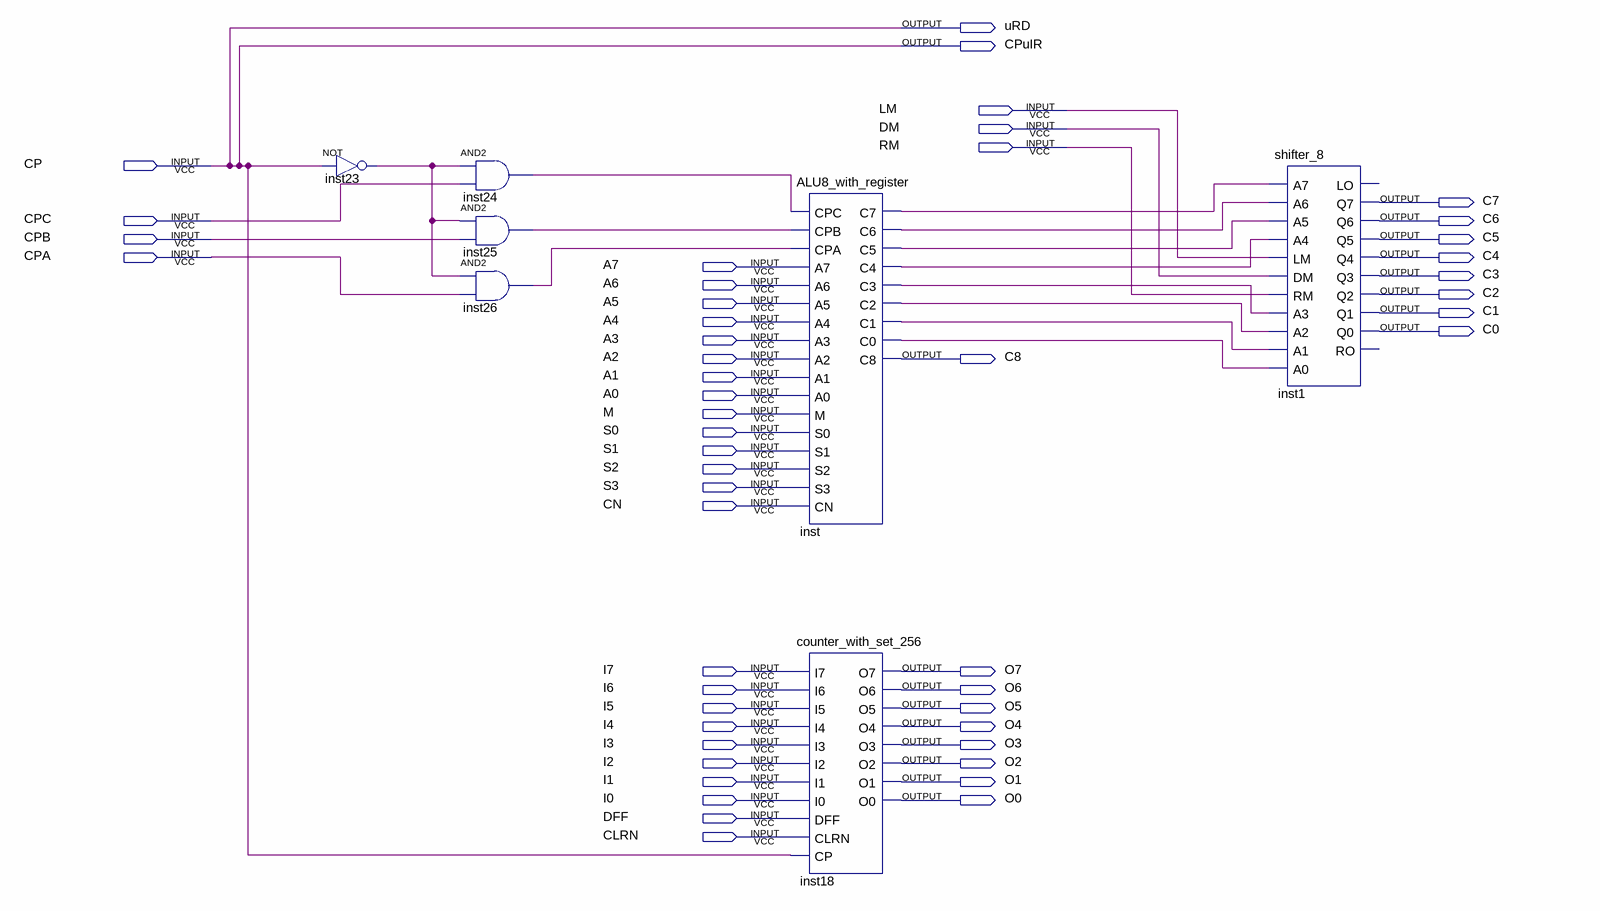
[diagram p0: schematic sheet]
// Quartus schematic ALU8_with_Microinstruction.bdf as structural Verilog: 7 symbols, 50 pins
module ALU8_with_Microinstruction (
  input  LM,
  input  DM,
  input  RM,
  input  CP,
  input  CPC,
  input  CPB,
  input  CPA,
  input  A7,
  input  A6,
  input  A5,
  input  A4,
  input  A3,
  input  A2,
  input  A1,
  input  A0,
  input  M,
  input  S0,
  input  S1,
  input  S2,
  input  S3,
  input  CN,
  input  I7,
  input  I6,
  input  I5,
  input  I4,
  input  I3,
  input  I2,
  input  I1,
  input  I0,
  input  DFF,
  input  CLRN,
  output uRD,
  output CPuIR,
  output C7,
  output C6,
  output C5,
  output C4,
  output C3,
  output C2,
  output C1,
  output C0,
  output C8,
  output O7,
  output O6,
  output O5,
  output O4,
  output O3,
  output O2,
  output O1,
  output O0
);

  wire inst23_out, inst24_out, inst25_out, inst26_out, inst_c0, inst_c1, inst_c2, inst_c3, inst_c4, inst_c5,
       inst_c6, inst_c7;

  not inst23 (inst23_out, CP);
  and inst24 (inst24_out, inst23_out, CPC);
  and inst25 (inst25_out, inst23_out, CPB);
  and inst26 (inst26_out, inst23_out, CPA);
  ALU8_with_register inst (
    .CPC(inst24_out), .CPB(inst25_out), .CPA(inst26_out), .A7(A7), .A6(A6), .A5(A5), .A4(A4), .A3(A3),
    .A2(A2), .A1(A1), .A0(A0), .M(M), .S0(S0), .S1(S1), .S2(S2), .S3(S3), .CN(CN), .C7(inst_c7),
    .C6(inst_c6), .C5(inst_c5), .C4(inst_c4), .C3(inst_c3), .C2(inst_c2), .C1(inst_c1), .C0(inst_c0), .C8(C8));
  counter_with_set_256 inst18 (
    .I7(I7), .I6(I6), .I5(I5), .I4(I4), .I3(I3), .I2(I2), .I1(I1), .I0(I0), .DFF(DFF), .CLRN(CLRN), .CP(CP),
    .O7(O7), .O6(O6), .O5(O5), .O4(O4), .O3(O3), .O2(O2), .O1(O1), .O0(O0));
  shifter_8 inst1 (
    .A7(inst_c7), .A6(inst_c6), .A5(inst_c5), .A4(inst_c4), .LM(LM), .DM(DM), .RM(RM), .A3(inst_c3),
    .A2(inst_c2), .A1(inst_c1), .A0(inst_c0), .Q7(C7), .Q6(C6), .Q5(C5), .Q4(C4), .Q3(C3), .Q2(C2), .Q1(C1),
    .Q0(C0));  // open: LO, RO

  assign CPuIR = CP;
  assign uRD = CP;
endmodule
